# Altium schematic sheet Sheet1.SchDoc
size A4
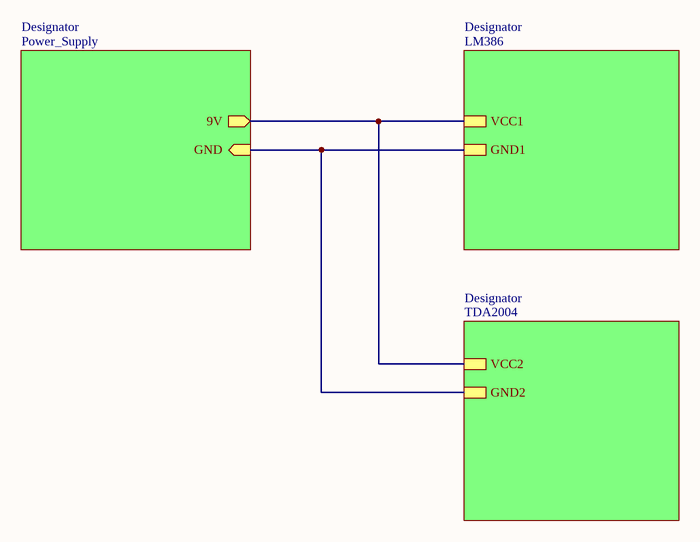
[diagram p0: Sheet1.SchDoc]

## Sub-sheets
Designator = Power_Supply: 9V (out), GND (in)
Designator = LM386: VCC1, GND1
Designator = TDA2004: GND2, VCC2

## Nets
(unnamed): sheet Designator/9V, sheet Designator/VCC1, sheet Designator/VCC2
(unnamed): sheet Designator/GND, sheet Designator/GND1, sheet Designator/GND2